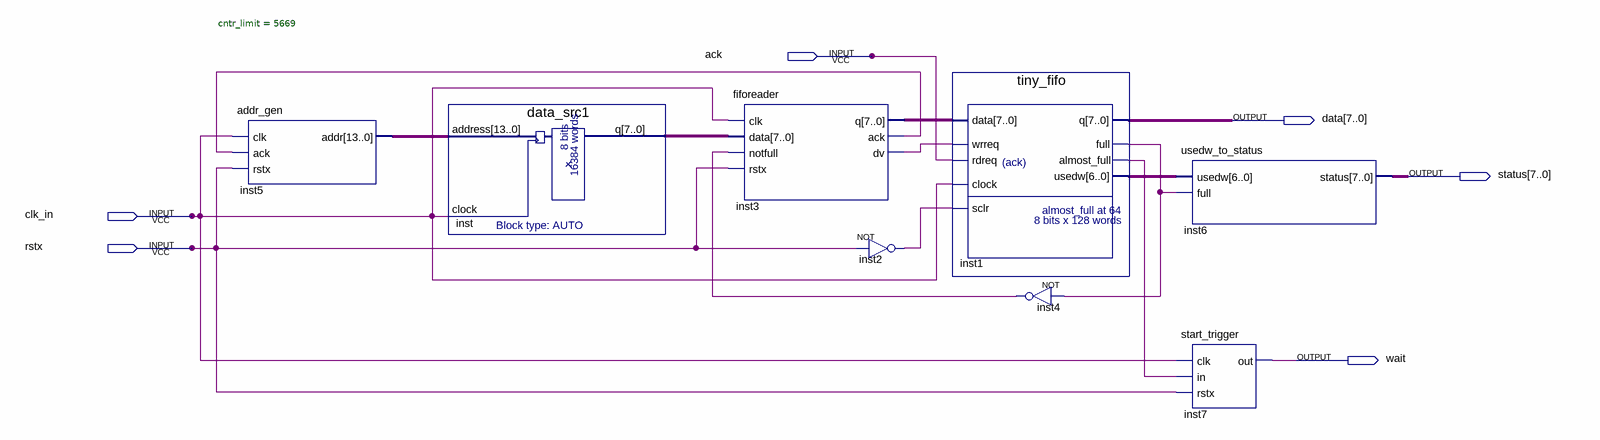
[diagram p0: schematic sheet]
// Quartus schematic stream_source_1.bdf as structural Verilog: 8 symbols, 6 pins
module stream_source_1 (
  input  ack,
  input  clk_in,
  input  rstx,
  output [7:0] data,
  output [7:0] status,
  output \wait 
);

  wire inst1_almost_full, inst1_full, inst2_out, inst3_ack, inst3_dv, inst4_out;
  wire [6:0] inst1_usedw;
  wire [7:0] inst3_q, inst_q;
  wire [13:0] inst5_addr;

  addr_gen #(.cntr_limit(5669)) inst5 (.clk(clk_in), .ack(inst3_ack), .rstx(rstx), .addr(inst5_addr));
  data_src1 inst (.address(inst5_addr), .clock(clk_in), .q(inst_q));
  fiforeader inst3 (
    .clk(clk_in), .data(inst_q), .notfull(inst4_out), .rstx(rstx), .q(inst3_q), .ack(inst3_ack), .dv(inst3_dv));
  not inst2 (inst2_out, rstx);
  tiny_fifo inst1 (
    .data(inst3_q), .wrreq(inst3_dv), .rdreq(ack), .clock(clk_in), .sclr(inst2_out), .q(data),
    .full(inst1_full), .almost_full(inst1_almost_full), .usedw(inst1_usedw));
  not inst4 (inst4_out, inst1_full);
  usedw_to_status inst6 (.usedw(inst1_usedw), .full(inst1_full), .status(status));
  start_trigger inst7 (.clk(clk_in), .in(inst1_almost_full), .rstx(rstx), .out(\wait ));
endmodule
